# Altium schematic sheet EFUSE_TPS259460A_as_switch.SchDoc
size A3
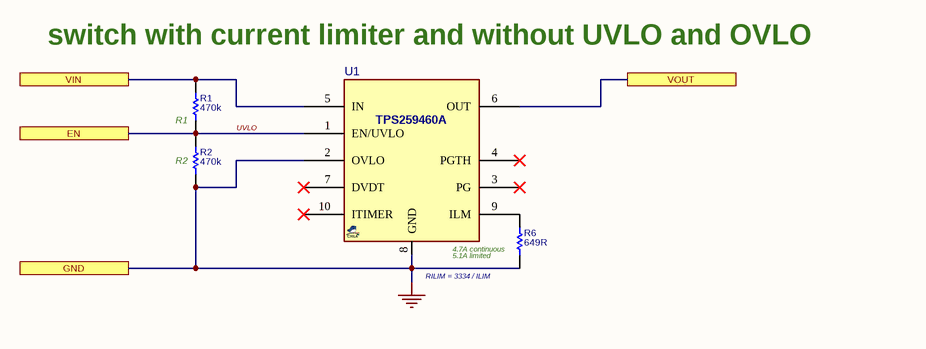
[diagram p0: EFUSE_TPS259460A_as_switch.SchDoc]

## Parts
R1  470k  [R0402A]
R2  470k  [R0402A]
R6  649R  [R0402]
U1  TPS259460A  [QFN45_10_2020_RPW]  (value not drawn)

## Ports
EN, GND, VIN, VOUT

## Nets
GND: R2.1 R6.1 U1.2(OVLO) U1.8(GND) ; port GND
UVLO: R1.1 R2.2 U1.1(EN/UVLO) ; port EN
VIN: R1.2 U1.5(IN) ; port VIN
VOUT: U1.6(OUT) ; port VOUT
NetR6_2: R6.2 U1.9(ILM)

Not connected (* = marked no-connect by the designer): U1 3(PG)* 4(PGTH)* 7(DVDT)* 10(ITIMER)*

## Notes on the sheet
- switch with current limiter and without UVLO and OVLO
- (near R2) R2
- (near R1) R1
- RILIM = 3334 / ILIM
- (near U1) 4.7A continuous
- (near U1) 5.1A limited

## Library data of the parts
R1 R2 R6 = RES_SMD: RESISTOR, SMD; PARAM: 0.063W; DESC: DESCRIPTION; DIST#: MOUSER; PARAM2: 1%; MANF_P#: -; MANF: -; ASSEMBLY: ASSEMBLY; PRICE: 100= 0.3$; PACKAGE: 0402
  R1 R2: VALUE: 470k
  R6: VALUE: 649R
U1 = TPS259460A_QFN10: LOAD SW, 2.7~23V eFuse, 0.5~6A, 28mOhm, OVP+UVLO, autoretry; MANF: TI; MANF_P#: TPS259460ARPW; PARAM2: 2.7~23V, OVP, autoretry; PARAM: 0.5~6A, 28mOhm; PRICE: 1$; VALUE: TPS259460A